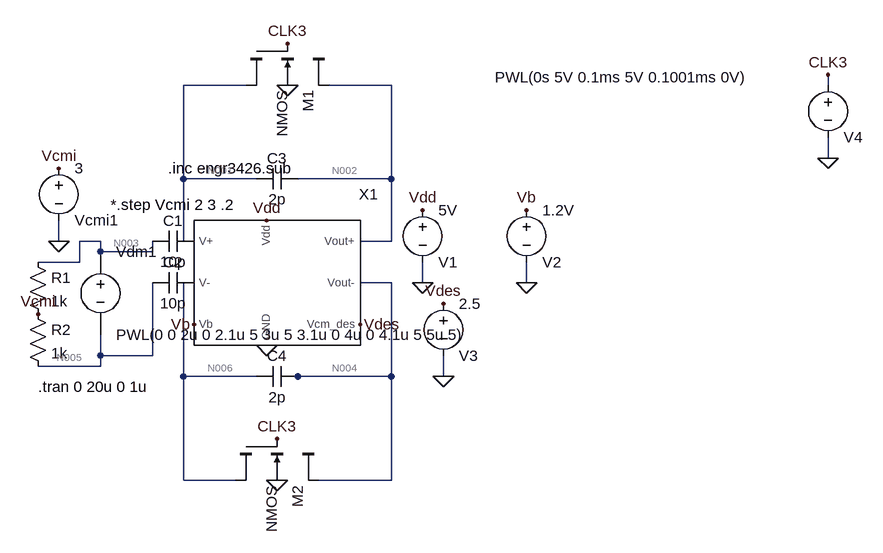
[diagram p0: schematic Draft2.asc]
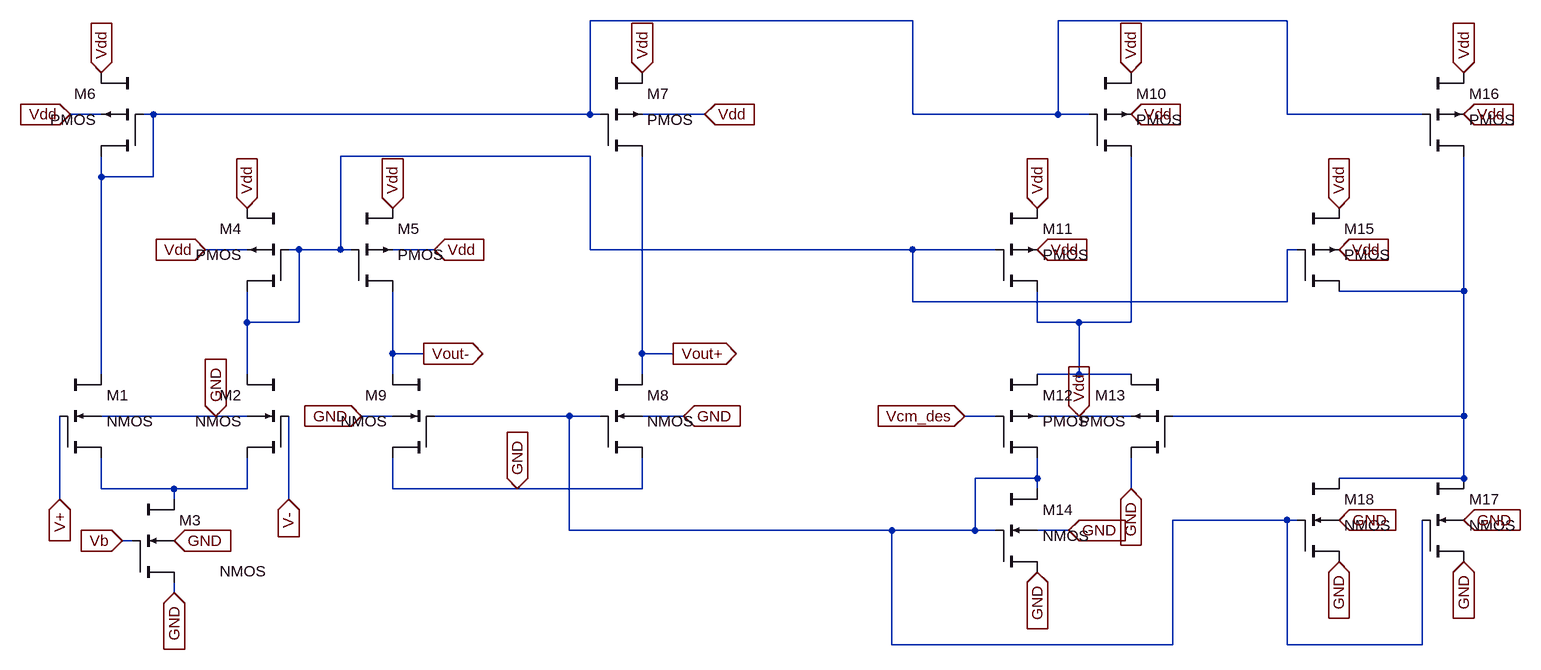
[diagram p1: sub-circuit cmfbdiffamp.asc]
Draft2.asc, the LTspice schematic file:
Version 4
SHEET 1 920 680
WIRE -32 -176 -128 -176
WIRE 192 -176 96 -176
WIRE 864 -176 864 -192
WIRE 864 -64 864 -96
WIRE -128 -32 -128 -176
WIRE -16 -32 -128 -32
WIRE 192 -32 192 -176
WIRE 192 -32 48 -32
WIRE -320 64 -320 32
WIRE -256 64 -288 64
WIRE -128 64 -128 -32
WIRE 192 64 192 -32
WIRE 192 64 144 64
WIRE -256 80 -256 64
WIRE -176 80 -176 64
WIRE -176 80 -256 80
WIRE -288 96 -288 64
WIRE -288 96 -352 96
WIRE 192 128 144 128
WIRE 240 128 240 96
WIRE 400 128 400 96
WIRE -256 240 -256 208
WIRE -176 240 -176 128
WIRE -176 240 -256 240
WIRE -256 256 -256 240
WIRE -256 256 -352 256
WIRE -128 272 -128 128
WIRE -16 272 -128 272
WIRE 48 272 32 272
WIRE 192 272 192 128
WIRE 192 272 48 272
WIRE 272 272 272 240
WIRE -128 432 -128 272
WIRE -48 432 -128 432
WIRE 192 432 192 272
WIRE 192 432 80 432
FLAG 240 128 0
FLAG 240 16 Vdd
FLAG 400 16 Vb
FLAG 400 128 0
FLAG 0 32 Vdd
FLAG 0 224 0
FLAG -112 192 Vb
FLAG 272 272 0
FLAG 272 160 Vdes
FLAG 144 192 Vdes
FLAG -320 64 0
FLAG -320 -48 Vcmi
FLAG -352 176 Vcmi
FLAG 32 -176 0
FLAG 32 -240 CLK3
FLAG 16 432 0
FLAG 16 368 CLK3
FLAG 864 -64 0
FLAG 864 -192 CLK3
SYMBOL CMFBDiffAmp 0 128 R0
SYMATTR InstName X1
SYMBOL voltage 240 0 R0
WINDOW 0 24 96 Left 2
WINDOW 3 24 16 Left 2
WINDOW 123 0 0 Left 2
WINDOW 39 0 0 Left 2
SYMATTR InstName V1
SYMATTR Value 5V
SYMBOL voltage 400 0 R0
WINDOW 0 24 96 Left 2
WINDOW 3 24 16 Left 2
WINDOW 123 0 0 Left 2
WINDOW 39 0 0 Left 2
SYMATTR InstName V2
SYMATTR Value 1.2V
SYMBOL voltage 272 144 R0
WINDOW 0 24 96 Left 2
WINDOW 3 24 16 Left 2
WINDOW 123 0 0 Left 2
WINDOW 39 0 0 Left 2
SYMATTR InstName V3
SYMATTR Value 2.5
SYMBOL voltage -320 -64 R0
WINDOW 0 24 96 Left 2
WINDOW 3 24 16 Left 2
WINDOW 123 0 0 Left 2
WINDOW 39 0 0 Left 2
SYMATTR InstName Vcmi1
SYMATTR Value 3
SYMBOL cktsym\\vsource -256 144 R0
WINDOW 39 0 0 Left 2
SYMATTR Value PWL(0 0 2u 0 2.1u 5 3u 5 3.1u 0 4u 0 4.1u 5 5u 5)
SYMATTR InstName Vdm1
SYMATTR Value2 AC 1 0
SYMBOL res -368 80 R0
SYMATTR InstName R1
SYMATTR Value 1k
SYMBOL res -368 160 R0
SYMATTR InstName R2
SYMATTR Value 1k
SYMBOL cap -112 48 R90
WINDOW 0 0 32 VBottom 2
WINDOW 3 32 32 VTop 2
SYMATTR InstName C1
SYMATTR Value 10p
SYMBOL cap -112 112 R90
WINDOW 0 0 32 VBottom 2
WINDOW 3 32 32 VTop 2
SYMATTR InstName C2
SYMATTR Value 10p
SYMBOL cap 48 -48 R90
WINDOW 0 0 32 VBottom 2
WINDOW 3 32 32 VTop 2
SYMATTR InstName C3
SYMATTR Value 2p
SYMBOL cap 48 256 R90
WINDOW 0 0 32 VBottom 2
WINDOW 3 32 32 VTop 2
SYMATTR InstName C4
SYMATTR Value 2p
SYMBOL cktsym\\nmos4 32 -176 R90
SYMATTR InstName M1
SYMATTR Value2 l=1.8um w=1.8um
SYMBOL cktsym\\nmos4 16 432 R90
SYMATTR InstName M2
SYMATTR Value2 l=1.8um w=1.8um
SYMBOL voltage 864 -192 R0
WINDOW 0 24 96 Left 2
WINDOW 3 -513 4 Left 2
WINDOW 123 0 0 Left 2
WINDOW 39 0 0 Left 2
SYMATTR InstName V4
SYMATTR Value PWL(0s 5V 0.1ms 5V 0.1001ms 0V)
TEXT -352 288 Left 2 !.tran 0 20u 0 1u
TEXT -240 8 Left 2 !*.step Vcmi 2 3 .2
TEXT -152 -48 Left 2 !.inc engr3426.sub

cmfbdiffamp.asc, the sub-circuit schematic file:
Version 4
SHEET 1 2344 680
WIRE 1376 -432 880 -432
WIRE 1952 -432 1600 -432
WIRE 128 -288 80 -288
WIRE 208 -288 192 -288
WIRE 880 -288 880 -432
WIRE 880 -288 208 -288
WIRE 896 -288 880 -288
WIRE 1056 -288 960 -288
WIRE 1376 -288 1376 -432
WIRE 1600 -288 1600 -432
WIRE 1600 -288 1376 -288
WIRE 1648 -288 1600 -288
WIRE 1952 -288 1952 -432
WIRE 2160 -288 1952 -288
WIRE 880 -224 496 -224
WIRE 128 -192 128 -224
WIRE 208 -192 208 -288
WIRE 208 -192 128 -192
WIRE 352 -80 288 -80
WIRE 432 -80 416 -80
WIRE 496 -80 496 -224
WIRE 496 -80 432 -80
WIRE 512 -80 496 -80
WIRE 640 -80 576 -80
WIRE 880 -80 880 -224
WIRE 1376 -80 880 -80
WIRE 1504 -80 1376 -80
WIRE 1968 -80 1952 -80
WIRE 2224 -16 2224 -224
WIRE 2224 -16 2032 -16
WIRE 1376 0 1376 -80
WIRE 1952 0 1952 -80
WIRE 1952 0 1376 0
WIRE 352 32 352 -16
WIRE 432 32 432 -80
WIRE 432 32 352 32
WIRE 1568 32 1568 -16
WIRE 1632 32 1568 32
WIRE 1712 32 1712 -224
WIRE 1712 32 1632 32
WIRE 576 80 576 -16
WIRE 624 80 576 80
WIRE 960 80 960 -224
WIRE 1008 80 960 80
WIRE 128 112 128 -192
WIRE 352 112 352 32
WIRE 576 112 576 80
WIRE 960 112 960 80
WIRE 1632 112 1632 32
WIRE 1632 112 1568 112
WIRE 1712 112 1632 112
WIRE 304 176 128 176
WIRE 352 176 304 176
WIRE 576 176 528 176
WIRE 848 176 640 176
WIRE 896 176 848 176
WIRE 1024 176 960 176
WIRE 1504 176 1456 176
WIRE 1632 176 1568 176
WIRE 1712 176 1632 176
WIRE 2224 176 2224 -16
WIRE 2224 176 1776 176
WIRE 1568 272 1568 240
WIRE 1568 272 1472 272
WIRE 2224 272 2224 176
WIRE 2224 272 2032 272
WIRE 128 288 128 240
WIRE 240 288 128 288
WIRE 352 288 352 240
WIRE 352 288 240 288
WIRE 576 288 576 240
WIRE 768 288 576 288
WIRE 960 288 960 240
WIRE 960 288 768 288
WIRE 1568 288 1568 272
WIRE 1712 288 1712 240
WIRE 64 304 64 176
WIRE 240 304 240 288
WIRE 416 304 416 176
WIRE 1952 336 1776 336
WIRE 1968 336 1952 336
WIRE 848 352 848 176
WIRE 1344 352 848 352
WIRE 1472 352 1472 272
WIRE 1472 352 1344 352
WIRE 1504 352 1472 352
WIRE 1616 352 1568 352
WIRE 176 368 160 368
WIRE 240 448 240 432
WIRE 1344 528 1344 352
WIRE 1776 528 1776 336
WIRE 1776 528 1344 528
WIRE 1952 528 1952 336
WIRE 2160 528 2160 336
WIRE 2160 528 1952 528
FLAG 128 -352 Vdd
IOPIN 128 -352 In
FLAG 352 -144 Vdd
IOPIN 352 -144 In
FLAG 576 -144 Vdd
IOPIN 576 -144 In
FLAG 960 -352 Vdd
IOPIN 960 -352 In
FLAG 80 -288 Vdd
IOPIN 80 -288 In
FLAG 288 -80 Vdd
IOPIN 288 -80 In
FLAG 640 -80 Vdd
IOPIN 640 -80 In
FLAG 1056 -288 Vdd
IOPIN 1056 -288 In
FLAG 304 176 GND
IOPIN 304 176 In
FLAG 240 368 GND
IOPIN 240 368 In
FLAG 528 176 GND
IOPIN 528 176 In
FLAG 1024 176 GND
IOPIN 1024 176 In
FLAG 160 368 Vb
IOPIN 160 368 In
FLAG 64 304 V+
IOPIN 64 304 In
FLAG 416 304 V-
IOPIN 416 304 In
FLAG 1568 -80 Vdd
IOPIN 1568 -80 In
FLAG 1712 -288 Vdd
IOPIN 1712 -288 In
FLAG 1712 288 GND
IOPIN 1712 288 In
FLAG 1616 352 GND
IOPIN 1616 352 In
FLAG 1568 -144 Vdd
IOPIN 1568 -144 In
FLAG 1712 -352 Vdd
IOPIN 1712 -352 In
FLAG 2224 -352 Vdd
IOPIN 2224 -352 In
FLAG 2224 -288 Vdd
IOPIN 2224 -288 In
FLAG 2032 -144 Vdd
IOPIN 2032 -144 In
FLAG 2032 -80 Vdd
IOPIN 2032 -80 In
FLAG 2032 336 GND
IOPIN 2032 336 In
FLAG 2224 336 GND
IOPIN 2224 336 In
FLAG 2224 400 GND
IOPIN 2224 400 In
FLAG 2032 400 GND
IOPIN 2032 400 In
FLAG 1568 416 GND
IOPIN 1568 416 In
FLAG 624 80 Vout-
IOPIN 624 80 Out
FLAG 1008 80 Vout+
IOPIN 1008 80 Out
FLAG 1456 176 Vcm_des
IOPIN 1456 176 In
FLAG 1632 176 Vdd
IOPIN 1632 176 In
FLAG 240 448 GND
IOPIN 240 448 In
FLAG 768 288 GND
IOPIN 768 288 In
SYMBOL cktsym\\nmos4 128 176 R0
SYMATTR InstName M1
SYMATTR Value2 l=1.8um w=1.8um
SYMBOL cktsym\\nmos4 352 176 M0
SYMATTR InstName M2
SYMATTR Value2 l=1.8um w=1.8um
SYMBOL cktsym\\nmos4 240 368 R0
WINDOW 3 70 47 Left 2
SYMATTR InstName M3
SYMATTR Value2 l=1.8um w=1.8um
SYMBOL cktsym\\pmos4 352 -80 M0
SYMATTR InstName M4
SYMATTR Value2 l=1.8um w=1.8um
SYMBOL cktsym\\pmos4 576 -80 R0
SYMATTR InstName M5
SYMATTR Value2 l=1.8um w=1.8um
SYMBOL cktsym\\pmos4 128 -288 M0
SYMATTR InstName M6
SYMATTR Value2 l=1.8um w=1.8um
SYMBOL cktsym\\pmos4 960 -288 R0
SYMATTR InstName M7
SYMATTR Value2 l=1.8um w=1.8um
SYMBOL cktsym\\nmos4 960 176 R0
SYMATTR InstName M8
SYMATTR Value2 l=1.8um w=1.8um
SYMBOL cktsym\\nmos4 576 176 M0
SYMATTR InstName M9
SYMATTR Value2 l=1.8um w=1.8um
SYMBOL cktsym\\pmos4 1712 -288 R0
SYMATTR InstName M10
SYMATTR Value2 l=1.8um w=1.8um
SYMBOL cktsym\\pmos4 1568 -80 R0
SYMATTR InstName M11
SYMATTR Value2 l=1.8um w=1.8um
SYMBOL cktsym\\pmos4 1568 176 R0
SYMATTR InstName M12
SYMATTR Value2 l=1.8um w=1.8um
SYMBOL cktsym\\pmos4 1712 176 M0
SYMATTR InstName M13
SYMATTR Value2 l=1.8um w=1.8um
SYMBOL cktsym\\nmos4 1568 352 R0
SYMATTR InstName M14
SYMATTR Value2 l=1.8um w=1.8um
SYMBOL cktsym\\pmos4 2032 -80 R0
SYMATTR InstName M15
SYMATTR Value2 l=1.8um w=1.8um
SYMBOL cktsym\\pmos4 2224 -288 R0
SYMATTR InstName M16
SYMATTR Value2 l=1.8um w=1.8um
SYMBOL cktsym\\nmos4 2224 336 R0
SYMATTR InstName M17
SYMATTR Value2 l=1.8um w=1.8um
SYMBOL cktsym\\nmos4 2032 336 R0
SYMATTR InstName M18
SYMATTR Value2 l=1.8um w=1.8um

The netlist it stands for:
* Draft2.asc
XX1 0 P001 P002 Vb Vdd Vdes N002 N004 cmfbdiffamp
V1 Vdd 0 5V
V2 Vb 0 1.2V
V3 Vdes 0 2.5
Vcmi1 Vcmi 0 3
Vdm1 N003 N005 PWL(0 0 2u 0 2.1u 5 3u 5 3.1u 0 4u 0 4.1u 5 5u 5) AC 1 0
R1 N003 Vcmi 1k
R2 Vcmi N005 1k
C1 P001 N003 10p
C2 P002 N005 10p
C3 N002 N001 2p
C4 N004 N006 2p
M1 N002 CLK3 N001 0 NMOS l=1.8um w=1.8um
M2 N004 CLK3 N006 0 NMOS l=1.8um w=1.8um
V4 CLK3 0 PWL(0s 5V 0.1ms 5V 0.1001ms 0V)

* block symbol definitions
.subckt cmfbdiffamp GND V+ V- Vb Vdd Vcm_des Vout+ Vout-
M1 N001 V+ N006 GND NMOS l=1.8um w=1.8um
M2 N002 V- N006 GND NMOS l=1.8um w=1.8um
M3 N006 Vb GND GND NMOS l=1.8um w=1.8um
M4 N002 N002 Vdd Vdd PMOS l=1.8um w=1.8um
M5 Vout- N002 Vdd Vdd PMOS l=1.8um w=1.8um
M6 N001 N001 Vdd Vdd PMOS l=1.8um w=1.8um
M7 Vout+ N001 Vdd Vdd PMOS l=1.8um w=1.8um
M8 Vout+ N005 GND GND NMOS l=1.8um w=1.8um
M9 Vout- N005 GND GND NMOS l=1.8um w=1.8um
M10 N004 N001 Vdd Vdd PMOS l=1.8um w=1.8um
M11 N004 N002 Vdd Vdd PMOS l=1.8um w=1.8um
M12 N005 Vcm_des N004 Vdd PMOS l=1.8um w=1.8um
M13 GND N003 N004 Vdd PMOS l=1.8um w=1.8um
M14 N005 N005 GND GND NMOS l=1.8um w=1.8um
M15 N003 N002 Vdd Vdd PMOS l=1.8um w=1.8um
M16 N003 N001 Vdd Vdd PMOS l=1.8um w=1.8um
M17 N003 N005 GND GND NMOS l=1.8um w=1.8um
M18 N003 N005 GND GND NMOS l=1.8um w=1.8um
.ends cmfbdiffamp

.model NMOS NMOS
.model PMOS PMOS
.lib standard.mos
.tran 0 20u 0 1u
*.step Vcmi 2 3 .2
.inc engr3426.sub
.backanno
.end

* Results of the author's LTspice run, read from the files saved beside the schematic
* Operating Point, zero values left out:
*   V(p002) = 3 V
*   V(vb) = 1.2 V
*   V(vdd) = 5 V
*   V(n004) = 4.649 V
*   V(n002) = 1.073 µV
*   V(vdes) = 2.5 V
*   V(vcmi) = 3 V
*   V(n003) = 3 V
*   V(n005) = 3 V
*   V(n001) = 1.073 µV
*   V(n006) = 4.649 V
*   V(clk3) = 5 V
*   Id(M2) = 9.317 pA
*   Ib(M2) = -9.317 pA
*   I(V1) = -50.4 µA
*   Ix(x1:GND) = -50.4 µA
*   Ix(x1:VDD) = 50.4 µA
*   Ix(x1:VOUT-) = -9.317 pA
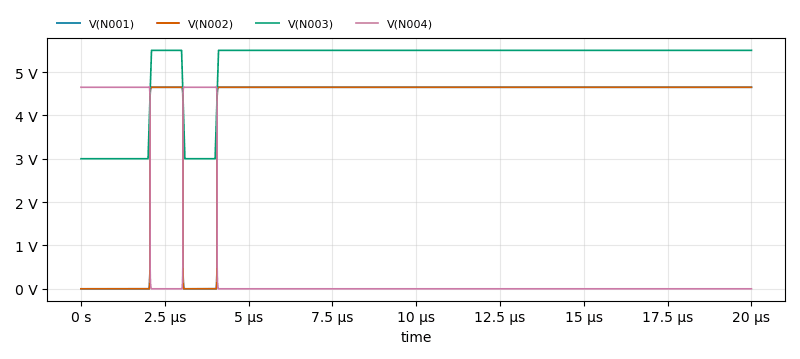
[diagram p2: Transient Analysis of Draft2.asc, plotted from the saved traces]
* Transient Analysis, 1 run:
*   V(N001): min 997.3 nV, max 4.654 V, average 3.933 V, rms 4.275 V, last 4.649 V
*   V(N002): min 1.072 µV, max 4.654 V, average 3.933 V, rms 4.275 V, last 4.649 V
*   V(N003): min 3 V, max 5.5 V, average 5.119 V, rms 5.196 V, last 5.5 V
*   V(N004): min 0 V, max 4.659 V, average 716.5 mV, rms 1.824 V, last 1.103 µV